# EAGLE design i3_Button-v03(4_4) (EAGLE 7.5.0)
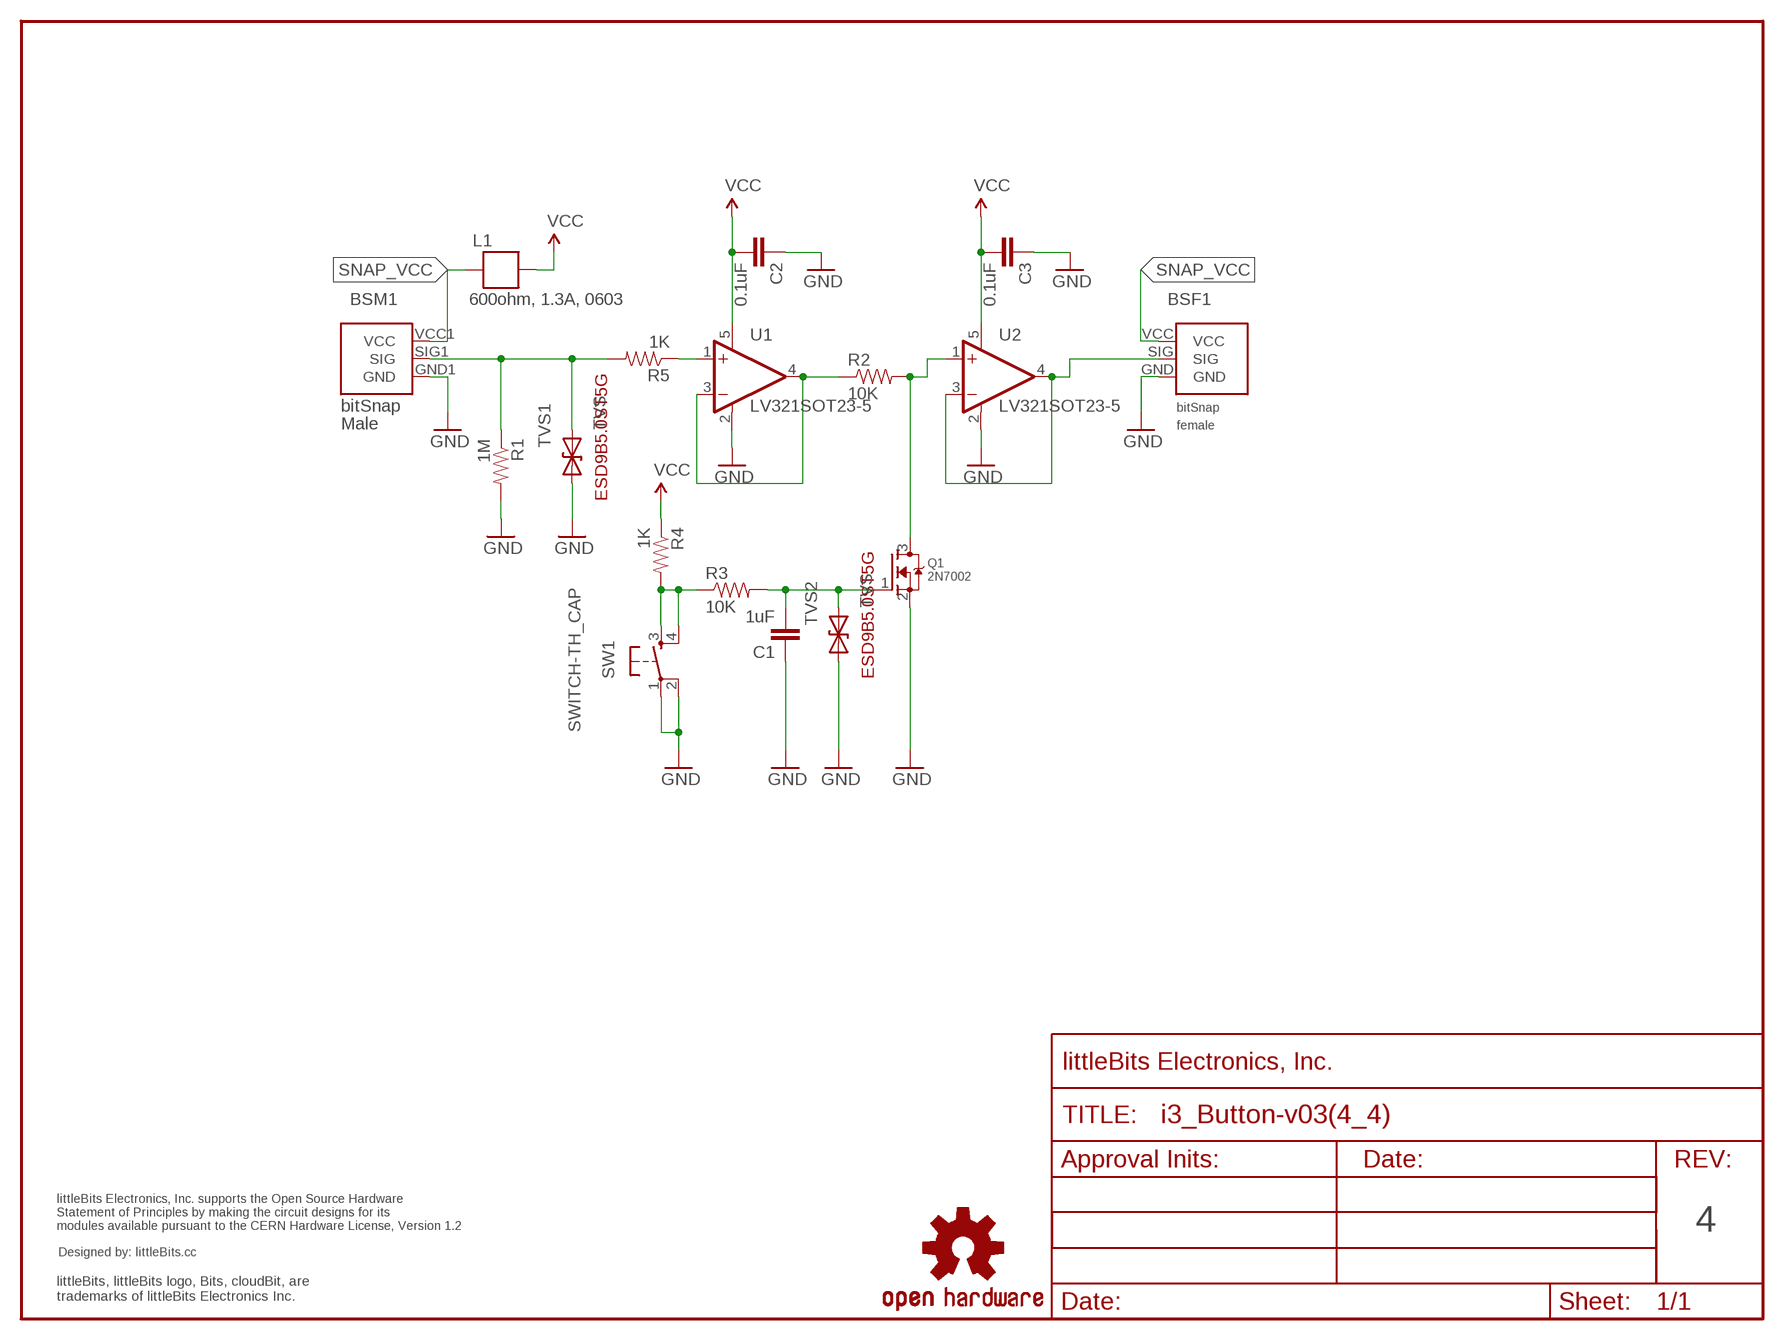
[diagram p0: schematic, sheet 1]

## Parts
BSF1  BITSNAP_V03_FEMALE  [BITSNAP_V03_FEMALE]
BSM1  BITSNAP_V03_MALE  [BITSNAP_V03_MALE]
C1  1uF  CAP0603-CAP  [0603-CAP]
C2  0.1uF  CAP0603-CAP  [0603-CAP]
C3  0.1uF  CAP0603-CAP  [0603-CAP]
FRAME1  FRAME-LETTER-OHWOHW  [FABDWG01-OHW]
L1  600ohm, 1.3A, 0603  FERRITE-BEAD  [R0603]
Q1  2N7002  MOSFET-NREFLOW  [SOT23]
R1  1M  RESISTOR0603-RES  [0603-RES]
R2  10K  RESISTOR0603-RES  [0603-RES]
R3  10K  RESISTOR0603-RES  [0603-RES]
R4  1K  RESISTOR0603-RES  [0603-RES]
R5  1K  RESISTOR0603-RES  [0603-RES]
SW1  SWITCH-TH_CAP  [SWITCH-TH_CAP]
TVS1  TVS  DIODE-TVSSOD-923  [SOD-923]
TVS2  TVS  DIODE-TVSSOD-923  [SOD-923]
U1  LV321SOT23-5  [SOT23-5]
U2  LV321SOT23-5  [SOT23-5]
U$1  OSHW-LOGOL  [OSHW-LOGO-L]
U$2  OSHWCREDIT  [OSHWCREDIT]

## Nets
GND: BSF1.GND BSM1.GND1(GND) C1.1 C2.1 C3.1 Q1.2(S) R1.2 SW1.1 SW1.2 TVS1.1(A) TVS2.1(A) U1.2(V-) U2.2(V-)
N$1: R2.1 U1.3(-IN) U1.4(OUT)
N$2: BSM1.SIG1(SIG) R1.1 R5.2 TVS1.2(C)
N$3: R5.1 U1.1(+IN)
N$5: Q1.3(D) R2.2 U2.1(+IN)
N$6: BSF1.SIG U2.3(-IN) U2.4(OUT)
N$7: C1.2 Q1.1(G) R3.2 TVS2.2(C)
N$8: R3.1 R4.2 SW1.3 SW1.4
SNAP_VCC: BSF1.VCC BSM1.VCC1(VCC) L1.2
VCC: C2.2 C3.2 L1.1 R4.1 U1.5(V+) U2.5(V+)

## Notes on the sheet
- 4

## Library data of the parts
BSF1 = bitSnap:BITSNAP_V03_FEMALE
BSM1 = bitSnap:BITSNAP_V03_MALE
C1-C3 = SparkFun:CAP: Capacitor Standard 0603 ceramic capacitor, and 0.1" leaded capacitor.
FRAME1 = LITTLEBITS:FRAME-LETTER-OHW; BOM: EXCLUDE
L1 = LITTLEBITS:FERRITE-BEAD
Q1 = adafruit:MOSFET-N: N-Channel Mosfet 2N7002E - 60V 260mA SOT23 [Digikey: 2N7002ET1GOSTR-ND] - REEL BSH103 - 30V 850mA SOT23 [Digikey: 568-5013-1-ND]
R1-R5 = SparkFun:RESISTOR: Resistor Basic schematic elements and footprints for 0603, 1206, and PTH 1/10th watt (small) resistors.
SW1 = LITTLEBITS:SWITCH-TH_CAP
TVS1 TVS2 = LITTLEBITS:DIODE-TVS: Bidirectional Transient Voltage Suppression Diode: Device conducts in avalanche mode after reaching a part dependent voltage threshold. Used for limiting voltage spikes on ESD sensitive inputs and outputs.; IEC_ESD_PROT0: +/-18kV; LB_PN: ?; MPN: ESD9B5.0ST5G; V_CLAMP: ?; V_OPERATION: 5V
U1 U2 = LITTLEBITS:LV321
U$1 = SparkFun:OSHW-LOGO: Open Source Hardware Logo This logo indicates the piece of hardware it is found on incorporates a OSHW license and/or adheres to the definition of open source hardware found here: http://freedomdefined.org/OSHW
U$2 = LITTLEBITS:OSHWCREDIT

## Board
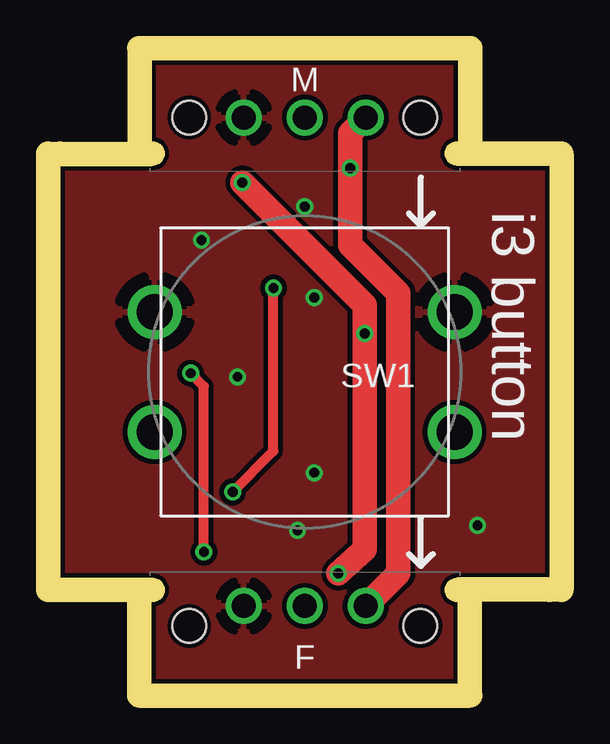
[diagram p1: board, top side]
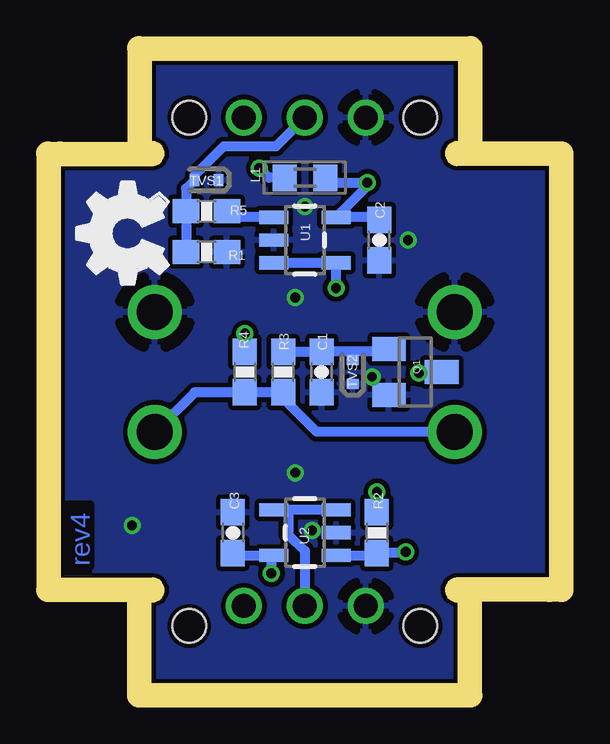
[diagram p2: board, bottom side, seen from below]

Size 20.4 x 26 mm. Coordinates in mm from the lower left corner, seen from the top.
Outline: 0,4.4 0,21.6
Outline: 20.4,21.6 20.4,4.4
Copper layers (1*16): Top 0.035mm / dielectric 1.5mm / Bottom 0.035mm
Design rules "littleBitsDRC": minimum track width 0.2mm, minimum drill 0.2mm, track to track 0.2mm, track to pad 0.2mm, pad to pad 0.2mm, via to via 0.2mm, smd to smd 0mil, copper to edge 0.2mm, drill to drill 0.2mm, minimum pad ring 0.1mm, minimum via ring 0.15mm, stop-mask expansion 0.1mm, vias tented up to drill 0.5mm, thermal gap 0.2mm
tRestrict: 8 lines
bRestrict: 8 lines
Milling: 6 lines

### Footprints (pad centres in the part's own frame; a part is rotated, then mirrored left to right if it is on the bottom)
BITSNAP_V03_FEMALE = drill 1: GND 4.065,3.44; SIG 6.605,3.44; VCC 9.145,3.44 | hole 1.4: 1.785,2.61; 11.425,2.61
BITSNAP_V03_MALE = drill 1: GND1 9.145,2.61; SIG1 6.605,2.61; VCC1 4.065,2.61 | hole 1.4: 1.785,2.61; 11.425,2.61
0603-CAP = smd 1.1 x 1: 1 -0.85,0; 2 0.85,0
R0603 = smd 1 x 1.1: 1 -0.85,0; 2 0.85,0
SOT23 = smd 1 x 1.4: 1 -0.95,-1.1; 2 0.95,-1.1; 3 0,1.1
0603-RES = smd 1.1 x 1: 1 -0.85,0; 2 0.85,0
SWITCH-TH_CAP = drill 1.5: 1 -0.25,8.5; 2 12.25,8.5; 3 -0.25,3.5; 4 12.25,3.5
SOD-923 = smd 0.4 x 0.5: 1 -0.5,0; 2 0.5,0
SOT23-5 = smd 0.55 x 1.2: 1 -0.95,-1.3; 2 0,-1.3; 3 0.95,-1.3; 4 0.95,1.3; 5 -0.95,1.3

### Placement (x,y rotation side)
BSF1  3.6,-0.21 0 top
BSM1  16.8,26.21 180 top
C1  9.5,12.99 90 bottom
C2  7.1,18.49 90 bottom
C3  13.2,6.29 270 bottom
DRILEGEND  [DRILEGEND]  -11.02,-23.98 0 top  (outside the outline)
FRAME1  3.6,-0.21 0 top
L1  10.2,21.09 180 bottom
Q1  5.6,12.99 270 bottom
R1  14.29,17.99 0 bottom
R2  7.2,6.29 270 bottom
R3  11.1,12.99 90 bottom
R4  12.7,12.99 270 bottom
R5  14.29,19.69 180 bottom
SW1  4.2,6.99 0 top
TVS1  14.29,20.99 180 bottom
TVS2  8.2,12.99 90 bottom
U1  10.2,18.49 270 bottom
U2  10.2,6.29 90 bottom
U$1  -22.46,-71.47 0 top  (outside the outline)
U$2  -84.25,-65.51 0 top  (outside the outline)
U$3  [OSHW_FILLX150_NOTEXT]  15.9,15.82 0 top

### Tracks (layer width: path | path; a pad name or v marks a point on that pad's centre or on a via)
GND  (via drill 0.41)
  other vias: 5.89,18.49 10.6,16.09 10.6,8.79 9.89,6.39 10.2,19.89 7.39,12.79 17.39,6.59
  pour Top: -0.17,-0.1 -0.25,26.19 20.47,26.24 20.61,-0.09
  pour Bottom: -0.19,-0.07 -0.18,26.23 20.62,26.14 20.71,-0.16
N$1  (via drill 0.41)
  Top 0.406: v7.2,7.99 8.89,9.69 v8.89,16.49
  Bottom 0.406: U1.3 U1.4 8.89,17.39 v8.89,16.49 | R2.1 v7.2,7.99
N$2
  Bottom 0.406: R5.2 R1.1 | 15.15,19.94 R5.2 | R5.2 15.15,20.64 TVS1.2 14.79,21.19 13.6,22.39 11.41,22.39 BSM1.SIG1
N$3
  Bottom 0.406: U1.1 13.45,19.44 R5.1
N$5  (via drill 0.41)
  Top 0.406: v6,5.49 6,12.39 v5.45,12.94
  Bottom 0.406: U2.1 7.2,5.34 R2.2 6.14,5.44 v6,5.49 | v5.45,12.94 4.54,12.94 Q1.3
N$6
  Bottom 0.406: U2.3 U2.4 10.89,7.24 10.89,6.19 10.2,5.54 BSF1.SIG
N$7
  Bottom 0.406: R3.2 C1.2 8.2,13.84 | Q1.1 6.7,13.84 8.2,13.84 | TVS2.2 8.2,13.84
N$8
  Bottom 0.406: SW1.3 9.7,10.49 11.1,11.89 R3.1 R4.2 14.79,12.14 SW1.4
SNAP_VCC  (via drill 0.41)
  Top 1.016: BSM1.VCC1 12.1,22.95 v12.1,21.49 12.1,18.29 14.1,16.29 14.1,4.58 BSF1.VCC
  Bottom 0.406: L1.2 11.7,21.09 v12.1,21.49
VCC  (via drill 0.41)
  Top 0.406: v12.7,14.59 12.74,14.59
  Top 1.016: v11.6,4.59 12.7,5.59 v12.7,14.59 12.7,15.79 v7.6,20.89
  Bottom 0.406: 13.2,5.34 C3.2 13.1,5.34 U2.5 11.6,5.24 v11.6,4.59 | C2.2 7.1,19.44 U1.5 7.6,20.74 v7.6,20.89 9.14,20.89 L1.1 | R4.1 v12.7,14.59

### Text on the board
Bottom: rev4
tPlace: i3 button
tNames: SW1
Milling: 1mm DIA. ROUTER PATH
Reference: MEDIUM
dxf: 4 | Button Module
DrillLegend: LAYER-STACK
DrillLegend_01-16: 01-16
DrillLegend_01-20: 01-20